# Altium schematic sheet DualDriverProp.SchDoc
size A
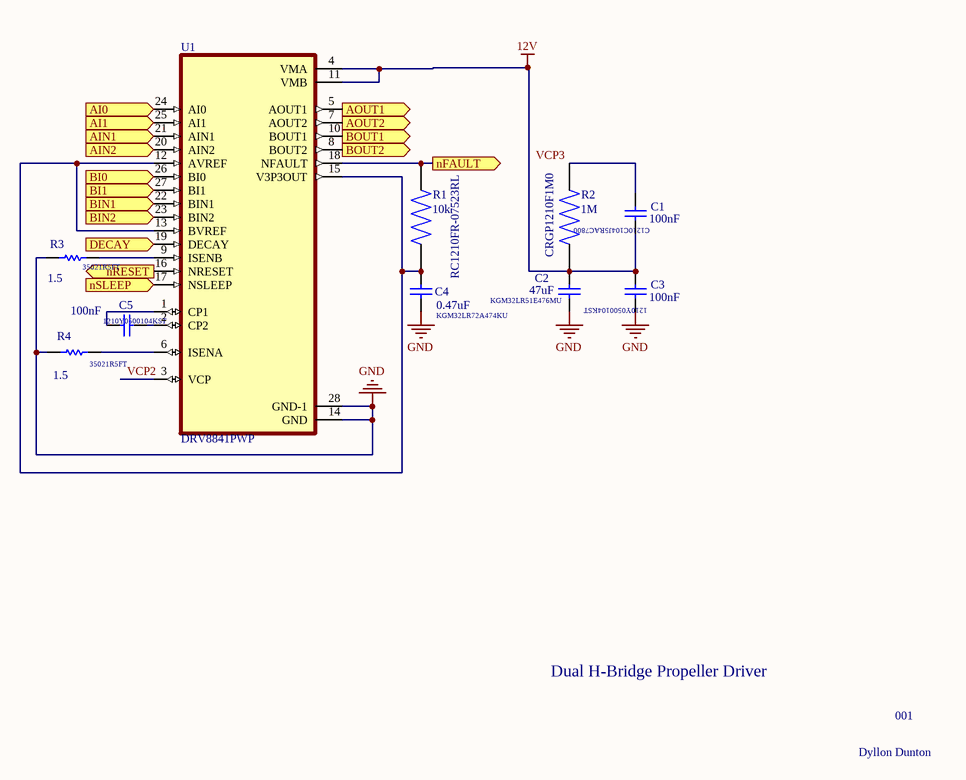
[diagram p0: DualDriverProp.SchDoc]

## Parts
C1  value 100nF  [C1210]  (hidden comment: Cap)
C2  value 47uF  [C1210]  (hidden comment: Cap)
C3  value 100nF  [C1210]  (hidden comment: Cap)
C4  value 0.47uF  [C1210]  (hidden comment: Cap)
C5  value 100nF  [C1210]  (hidden comment: Cap)
R1  RC1210FR-07523RL  value 10k  [RESC3126X65N]
R2  CRGP1210F1M0  value 1M  [RESC3126X65N]
R3  value 1.5  [RESC5025X70N]  (hidden comment: Res1)
R4  value 1.5  [RESC5025X70N]  (hidden comment: Res1)
U1  DRV8841PWP  [IC_TPS61196PWPRQ1]

## Ports
AI0 (in), AI1 (in), AIN1 (in), AIN2 (in), AOUT1 (out), AOUT2 (out), BI0 (in), BI1 (in), BIN1 (in), BIN2 (in), BOUT1 (out), BOUT2 (out), DECAY (in), nFAULT (out), nRESET (in), nSLEEP (in)

## Nets
12V: C1.2 C2.2 C3.1 R2.1 U1.4(VMA) U1.11(VMB)
GND: C2.1 C3.2 C4.1 R3.1 R4.1 U1.14(GND) U1.28(GND-1)
AI0: U1.24(AI0) ; port AI0
AI1: U1.25(AI1) ; port AI1
AIN1: U1.21(AIN1) ; port AIN1
AIN2: U1.20(AIN2) ; port AIN2
AOUT1: U1.5(AOUT1) ; port AOUT1
AOUT2: U1.7(AOUT2) ; port AOUT2
BI0: U1.26(BI0) ; port BI0
BI1: U1.27(BI1) ; port BI1
BIN1: U1.22(BIN1) ; port BIN1
BIN2: U1.23(BIN2) ; port BIN2
BOUT1: U1.10(BOUT1) ; port BOUT1
BOUT2: U1.8(BOUT2) ; port BOUT2
DECAY: U1.19(DECAY) ; port DECAY
nFAULT: R1.2 U1.18(NFAULT) ; port nFAULT
nRESET: U1.16(NRESET) ; port nRESET
nSLEEP: U1.17(NSLEEP) ; port nSLEEP
VCP2: U1.3(VCP)
NetC1_1: C1.1 R2.2
NetC4_2: C4.2 R1.1 U1.12(AVREF) U1.13(BVREF) U1.15(V3P3OUT)
NetC5_1: C5.1 U1.2(CP2)
NetC5_2: C5.2 U1.1(CP1)
NetR3_2: R3.2 U1.9(ISENB)
NetR4_2: R4.2 U1.6(ISENA)

## Notes on the sheet
- (near R3) 35021R5FT
- (near C1) C1210C104J5RAC7800
- 1210Y0500104KST
- (near C4) KGM32LR72A474KU
- (near C2) KGM32LR51E476MU
- (near C3) 1210Y0500104KST
- (near R4) 35021R5FT
- Dual H-Bridge Propeller Driver
- 001
- Dyllon Dunton
- Labels drawn without touching a wire or pin: VCP3

## Library data of the parts
C1-C5 = Cap: Capacitor; Published: 8-Jun-2000; LatestRevisionDate: 17-Jul-2002; LatestRevisionNote: Re-released for DXP Platform.; PackageReference: RAD-0.3; Publisher: Altium Limited; PackageDescription: Radial Cap, Thru-Hole; 2 Leads; 0.3 in Pin Spacing
R1 R2 = RC1210FR-07523RL: 523 Ohms Â±1% 0.5W, 1/2W Chip Resistor 1210 _3225 Metric_ Moisture Resistant Thick Film; MF: Yageo; Package: 3126 Yageo; Availability: Unavailable; MP: RC1210FR-07523RL; SnapEDA_Link: https://www.snapeda.com/parts/RC1210FR-07523RL/Yageo/view-part/1091979/?ref=snap; Price: None
R3 R4 = Res1: Resistor; Published: 8-Jun-2000; LatestRevisionDate: 17-Jul-2002; LatestRevisionNote: Re-released for DXP Platform.; PackageReference: AXIAL-0.3; Publisher: Altium Limited; PackageDescription: Axial Device, Thru-Hole; 2 Leads; 0.3 in Pin Spacing
U1 = DRV8841PWP: 45-V, 2.5-A bipolar stepper or dual H-bridge motor driver IC with current regulation and PWM control; MF: Texas Instruments; Value: *; SnapEDA_Link: https://www.snapeda.com/parts/DRV8841PWP/Texas+Instruments/view-part/?ref=snap; Check_prices: https://www.snapeda.com/parts/DRV8841PWP/Texas+Instruments/view-part/?ref=eda; Purchase-URL: https://pricing.snapeda.com/search/part/DRV8841PWP/?ref=eda; Availability: In Stock; Price: None; Package: HTSSOP-28 Texas Instruments; MP: DRV8841PWP